# Altium schematic sheet PoE_Si3404.SchDoc: =project_title (part 1 of 3)
size Tabloid; CompanyName: Luxonis Holding; Organization: Luxonis Holding; Address1: 1925 Harmony Park Drive; Address2: Westminster, CO; Address3: 80234; Address4: United States; SheetNumber: 3; SheetTotal: 12
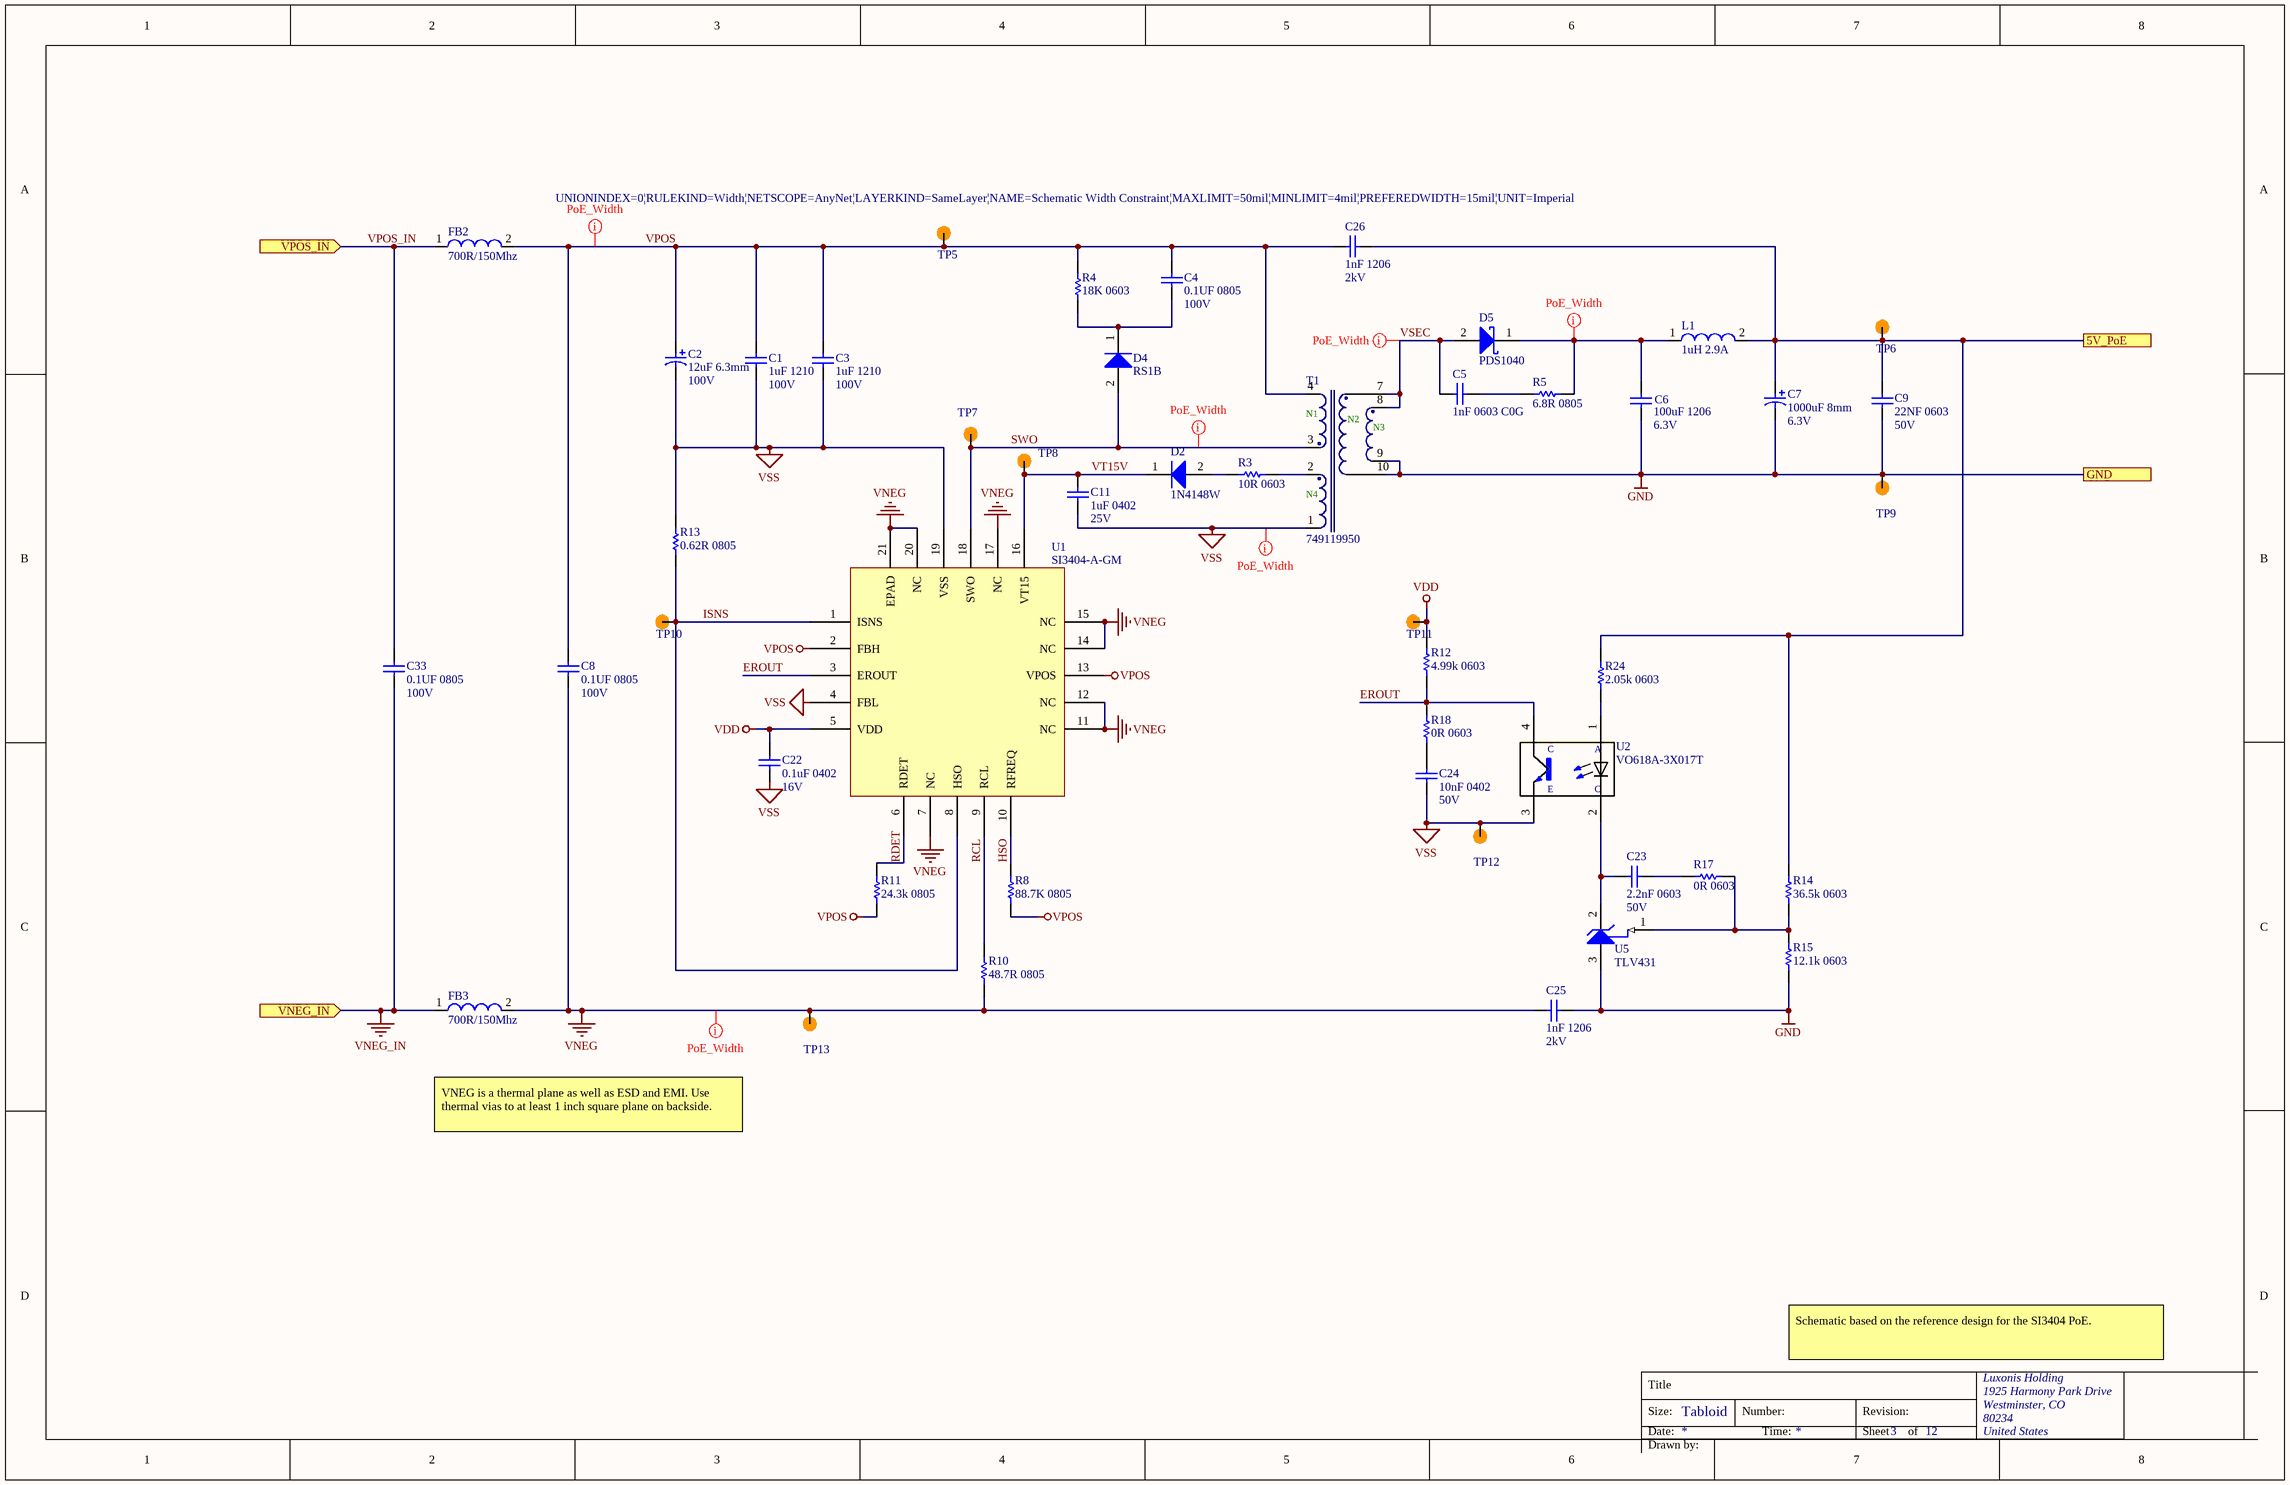
[diagram p0: PoE_Si3404.SchDoc]

## Parts
C1  1uF 1210  Voltage Rating: 100V  [CAPC1210(3225)280_N]
C2  12uF 6.3mm  Voltage: 100V  [EEU-FC2A120]
C3  1uF 1210  Voltage Rating: 100V  [CAPC1210(3225)280_N]
C4  0.1UF 0805  Voltage Rating: 100V  [CAPC0805(2012)145_N]
C5  1nF 0603 C0G  [CAPC0603(1608)100_N]
C6  100uF 1206  Voltage: 6.3V  [CAPC1206(3216)190_N]
C7  1000uF 8mm  Voltage: 6.3V  [ECA-0JM102]
C8  0.1UF 0805  Voltage Rating: 100V  [CAPC0805(2012)145_N]
C9  22NF 0603  Voltage: 50V  [CAPC0603(1608)100_N]
C11  1uF 0402  Voltage Rating: 25V  [CAPC0402(1005)70_N]
C22  0.1uF 0402  Voltage Rating: 16V  [CAPC0402(1005)60_N]
C23  2.2nF 0603  Voltage: 50V  [CAPC0603(1608)100_N]
C24  10nF 0402  Voltage Rating: 50V  [CAPC0402(1005)60_N]
C25  1nF 1206  Voltage Rating (DC): 2kV  [CAPC1206(3216)190_N]
C26  1nF 1206  Voltage Rating (DC): 2kV  [CAPC1206(3216)190_N]
C33  0.1UF 0805  Voltage Rating: 100V  [CAPC0805(2012)145_N]
D2  1N4148W  [1N4148W-7-F]
D4  RS1B  [RS1B]
D5  PDS1040  [PDS1040-13]
FB2  700R/150Mhz  [742792040]
FB3  700R/150Mhz  [742792040]
L1  1uH 2.9A  [DO1608C-102MLx]
R3  10R 0603  [RESC0603(1608)_N]
R4  18K 0603  [RESC0603(1608)_N]
R5  6.8R 0805  [RESC0805(2012)_N]
R8  88.7K 0805  [RESC0805(2012)_N]
R10  48.7R 0805  [RESC0805(2012)_N]
R11  24.3k 0805  [RESC0805(2012)_N]
R12  4.99k 0603  [RESC0603(1608)_N]
R13  0.62R 0805  [RESC0805(2012)_N]
R14  36.5k 0603  [RESC0603(1608)_N]
R15  12.1k 0603  [RESC0603(1608)_N]
R17  0R 0603  [RESC0603(1608)_N]
R18  0R 0603  [RESC0603(1608)_N]
R24  2.05k 0603  [RESC0603(1608)_N]
T1  749119950  [749119950]
TP5  TP100_200_NS  [TP100_200_NS]  (value not drawn)  (no BOM)
TP6  TP100_200_NS  [TP100_200_NS]  (value not drawn)  (no BOM)
TP7  TP100_200_NS  [TP100_200_NS]  (value not drawn)  (no BOM)
TP8  TP100_200_NS  [TP100_200_NS]  (value not drawn)  (no BOM)
TP9  TP100_200_NS  [TP100_200_NS]  (value not drawn)  (no BOM)
TP10  TP100_200_NS  [TP100_200_NS]  (value not drawn)  (no BOM)
TP11  TP100_200_NS  [TP100_200_NS]  (value not drawn)  (no BOM)
TP12  TP100_200_NS  [TP100_200_NS]  (value not drawn)  (no BOM)
TP13  TP100_200_NS  [TP100_200_NS]  (value not drawn)  (no BOM)
U1  SI3404-A-GM  [Si3404-A-GM]
U2  VO618A-3X017T  [VO618A-3X017T]
U5  TLV431  [TLV431BCDBZR]

## Ports
5V_PoE, GND, VNEG_IN (in), VPOS_IN (in)

## Nets
GND: C6.1 C7.2 C9.1 C25.2 R15.1 T1.9 T1.10 TP9.1 U5.3(ANODE) ; port GND
VDD: C22.2 R12.2 TP11.1 U1.5(VDD)
VNEG: C8.1 C25.1 FB3.2 R10.1 TP13.1 U1.7(NC) U1.11(NC) U1.12(NC) U1.14(NC) U1.15(NC) U1.17(NC) U1.20(NC) U1.21(EPAD)
VNEG_IN: C33.1 FB3.1 ; port VNEG_IN
VPOS: C1.2 C2.1 C3.2 C4.2 C8.2 C26.1 FB2.2 R4.2 R8.1 R11.1 T1.4 TP5.1 U1.2(FBH) U1.13(VPOS)
VSS: C1.1 C2.2 C3.1 C11.1 C22.1 C24.1 R13.2 T1.1 TP12.1 U1.4(FBL) U1.19(VSS) U2.3(E)
5V_PoE: C7.1 C9.2 C26.2 L1.2 R14.2 R24.2 TP6.1 ; port 5V_PoE
EROUT: R12.1 R18.2 U1.3(EROUT) U2.4(CO)
HSO: R8.2 U1.10(RFREQ)
ISNS: R13.1 TP10.1 U1.1(ISNS) U1.8(HSO)
RCL: R10.2 U1.9(RCL)
RDET: R11.2 U1.6(RDET)
SWO: D4.2(A) T1.3 TP7.1 U1.18(SWO)
VPOS_IN: C33.2 FB2.1 ; port VPOS_IN
VSEC: C5.2 D5.2(A) T1.7 T1.8
VT15V: C11.2 D2.1(K) TP8.1 U1.16(VT15)
NetC4_1: C4.1 D4.1(K) R4.1
NetC5_1: C5.1 R5.1
NetC6_2: C6.2 D5.1(K) L1.1 R5.2
NetC23_1: C23.1 U2.2(C) U5.2(CATHODE)
NetC23_2: C23.2 R17.2
NetC24_2: C24.2 R18.1
NetD2_2: D2.2(A) R3.1
NetR3_2: R3.2 T1.2
NetR14_1: R14.1 R15.2 R17.1 U5.1(REF)
NetR24_1: R24.1 U2.1(A)

## Layout directives
rule Width Constraint [Pref Width = 15mil    Min Width = 4mil    Max Width = 50mil]; net class PoE: NetC6_2, SWO, VNEG, VPOS, VSEC, VSS

## Notes on the sheet
- VNEG is a thermal plane as well as ESD and EMI. Use thermal vias to at least 1 inch square plane on backside.
- Schematic based on the reference design for the SI3404 PoE.
- Title
- Size:
- Date:
- Tabloid
- Number:
- Time:
- Revision:
- Sheet
- of
- Drawn by:
- (in symbol 749119950) N1; N2; N3; N4